# Altium project 声光双控电路.PrjPCB
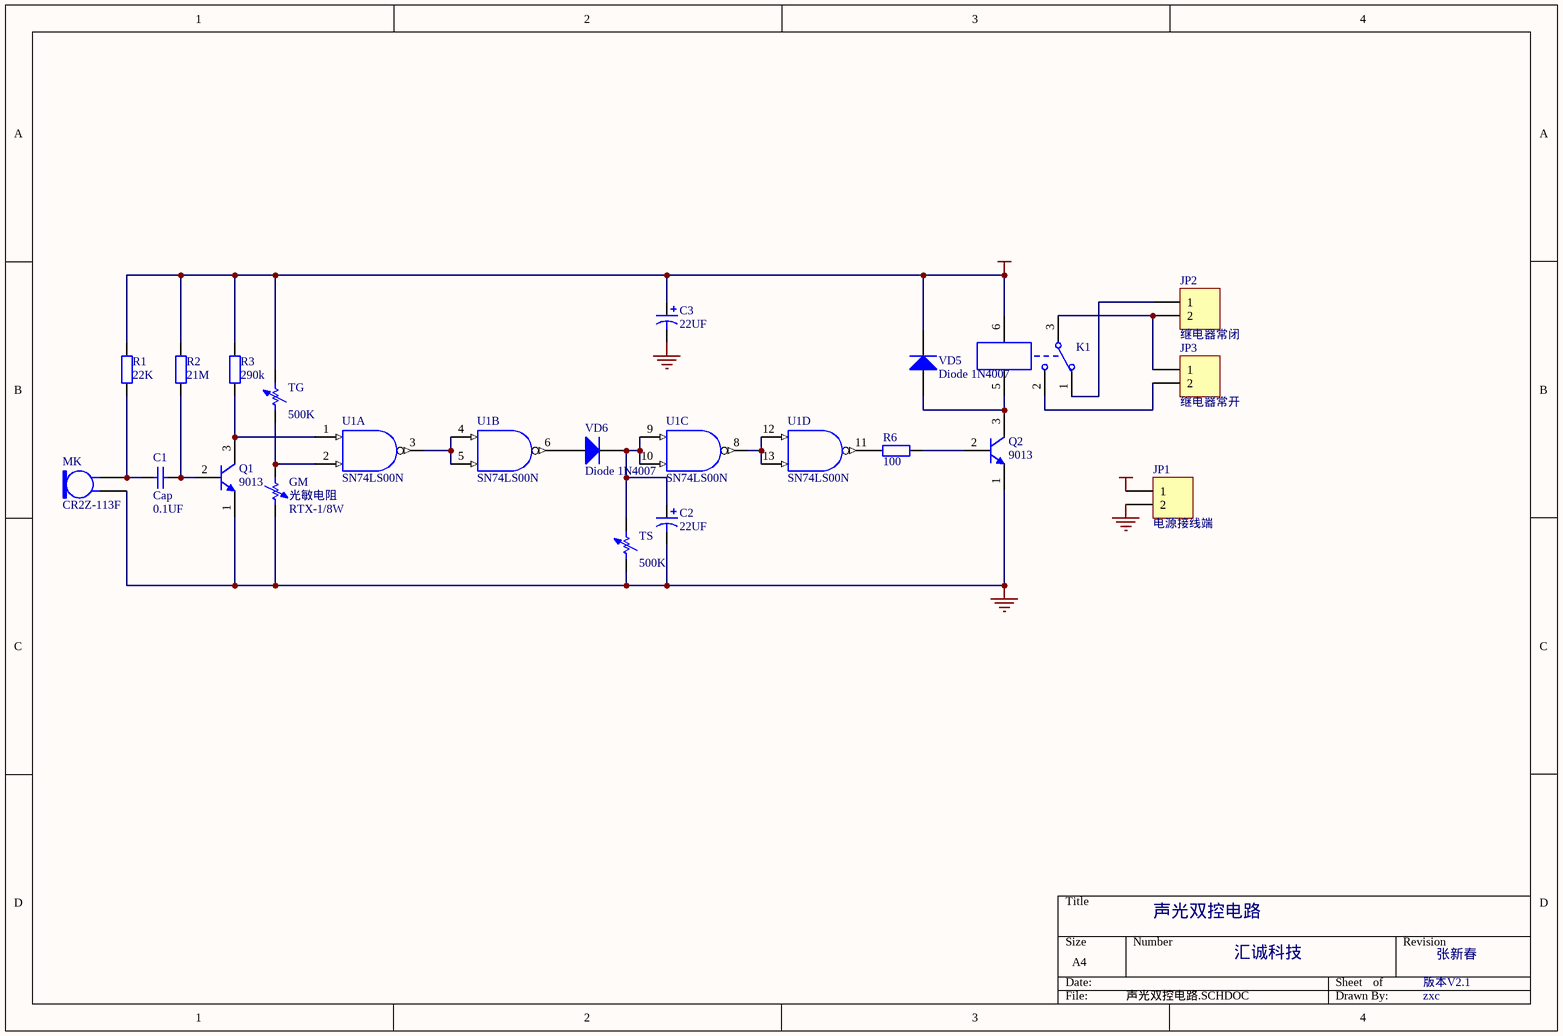
[diagram p0: 声光双控电路.SCHDOC]
1 sheet, 20 parts. Net scope: global (net labels, ports and power ports of the same name join across sheets).
Board file: 声光双控电路.PcbDoc

## Sheet 声光双控电路.SCHDOC
size A4

### Parts
C1  Cap  value 0.1UF  [HDR-2]
C2  22UF  [C-DJ-4]
C3  22UF  [C-DJ-4]
GM  光敏电阻  value RTX-1/8W  [HDR-2]
JP1  电源接线端  [JK128]
JP2  继电器常闭  [JK128]
JP3  继电器常开  [JK128]
K1  (no value)  [JDQPF]
MK  CR2Z-113F  [PIN2]
Q1  9013  [BCY-W3]
Q2  9013  [BCY-W3]
R1  22K  [HDR-2]
R2  21M  [HDR-2]
R3  290k  [HDR-2]
R6  100  [HDR-2]
TG  value 500K  [HDR-3]
TS  value 500K  [HDR-3]
U1  SN74LS00N  [DIP-14/D19.7]  (parts A,B,C,D of 4)
VD5  Diode 1N4007  [DIO7.8-4.6x2]
VD6  Diode 1N4007  [DIO7.8-4.6x2]

### Nets
GND: C2.2 C3.2 GM.2 JP1.2 MK.1 Q1.1(E) Q2.1(E) TS.1 U1.7(GND)
VCC: C3.1 JP1.1 K1.6 R1.2 R2.2 R3.2 TG.2 U1.14(VCC) VD5.2(K)
NetC1_1: C1.1 MK.2 R1.1
NetC1_2: C1.2 Q1.2(B) R2.1
NetC2_1: C2.1 TS.2 U1.9(A) U1.10(B) VD6.2(K)
NetGM_1: GM.1 TG.1 U1.2(B)
NetJP2_1: JP2.1 K1.1
NetJP2_2: JP2.2 JP3.1 K1.3
NetJP3_2: JP3.2 K1.2
NetK1_5: K1.5 Q2.3(C) VD5.1(A)
NetQ1_3: Q1.3(C) R3.1 U1.1(A)
NetQ2_2: Q2.2(B) R6.2
NetR6_1: R6.1 U1.11(Y)
NetU1_3: U1.3(Y) U1.4(A) U1.5(B)
NetU1_6: U1.6(Y) VD6.1(A)
NetU1_8: U1.8(Y) U1.12(A) U1.13(B)

### Notes on the sheet
- 声光双控电路
- 汇诚科技
- 版本V2.1
- 张新春
- zxc

### Library data of the parts
C1 = Cap: Capacitor; Published: 8-Jun-2000; LatestRevisionDate: 17-Jul-2002; LatestRevisionNote: Re-released for DXP Platform.; Publisher: Altium Limited
C2 C3 = Cap Pol1: Polarized Capacitor (Radial); Published: 8-Jun-2000; LatestRevisionDate: 17-Jul-2002; LatestRevisionNote: Re-released for DXP Platform.; Publisher: Altium Limited
GM TG TS = Res Adj1: Variable Resistor; Set Position: 0.5; Published: 8-Jun-2000; LatestRevisionDate: 17-Jul-2002; LatestRevisionNote: Re-released for DXP Platform.; Publisher: Altium Limited
JP1-JP3 = Header 2H: Header, 2-Pin, Right Angle; LatestRevisionDate: 17-Jul-2002; LatestRevisionNote: Re-released for DXP Platform.; Publisher: Altium Limited
K1 = Relay-SPDT: Single-Pole Dual-Throw Relay; Published: 24-Mar-1999; LatestRevisionDate: 17-Jul-2002; LatestRevisionNote: Re-released for DXP Platform.; Publisher: Altium Limited
MK = Mic2: Microphone; Published: 24-Mar-1999; LatestRevisionDate: 17-Jul-2002; LatestRevisionNote: Re-released for DXP Platform.; Publisher: Altium Limited
Q1 Q2 = NPN: NPN Bipolar Transistor; Published: 8-Jun-2000; LatestRevisionDate: 17-Jul-2002; LatestRevisionNote: Re-released for DXP Platform.; Publisher: Altium Limited; Code_JEDEC: TO-226-AA
R1-R3 R6 = Res2: Resistor; Published: 8-Jun-2000; LatestRevisionDate: 17-Jul-2002; LatestRevisionNote: Re-released for DXP Platform.; Publisher: Altium Limited
U1 = SN74LS00N: Quadruple 2-Input Positive-NAND Gate; Manufacturer: Texas Instruments; Class I: Logic; Published: 8-Jun-2000; Revision: July-2002: Re-released for DXP Platform.; Datasheet: Latest Revision: Mar-1988; Package Reference: N014; Publisher: Altium Limited; Class II: Gate
VD5 VD6 = Diode 1N4007: 1 Amp General Purpose Rectifier; Published: 8-Jun-2000; LatestRevisionDate: 17-Jul-2002; LatestRevisionNote: Re-released for DXP Platform.; DatasheetDocument: 1998; PackageDocument: Aug-1999; PackageReference: DO-41; Publisher: Altium Limited; Code_JEDEC: DO-204-AL